# EAGLE design encoder_breakout (EAGLE 9.6.0)
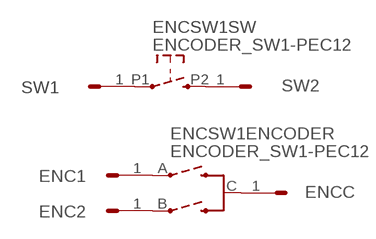
[diagram p0: schematic, sheet 1]

## Parts
ENC1  HEADER/MALE/01  [HEADER/MALE/01]
ENC2  HEADER/MALE/01  [HEADER/MALE/01]
ENCC  HEADER/MALE/01  [HEADER/MALE/01]
ENCSW1  ENCODER_SW1-PEC12  [PEC12_INCREMENTAL_ENCODER]
SW1  HEADER/MALE/01  [HEADER/MALE/01]
SW2  HEADER/MALE/01  [HEADER/MALE/01]

## Nets
N$1: ENC1.1 ENCSW1.A(ENCODER:A)
N$2: ENC2.1 ENCSW1.B(ENCODER:B)
N$3: ENCC.1 ENCSW1.C(ENCODER:C)
N$4: ENCSW1.P1 SW1.1
N$5: ENCSW1.P2 SW2.1

## Library data of the parts
ENC1 ENC2 ENCC SW1 SW2 = connectors:HEADER/MALE/01
ENCSW1 = controls:ENCODER_SW1: Incremental Encoder with push switch

## Board
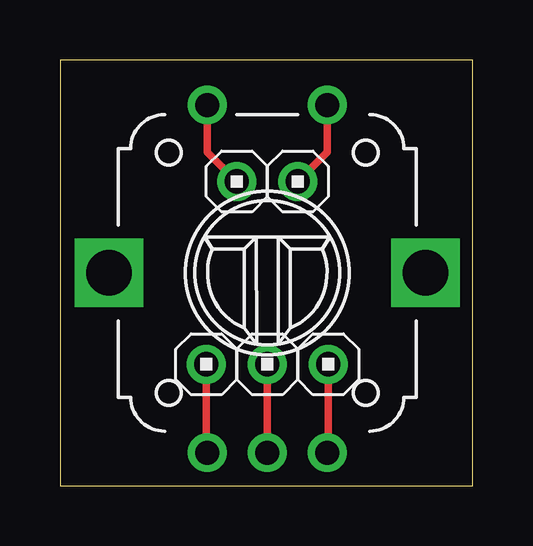
[diagram p1: board, top side]

Size 17.2 x 17.77 mm. Coordinates in mm from the lower left corner, seen from the top.
Outline: 0,0 17.2,0 17.2,17.77 0,17.77 0,0
Copper layers (1*16): Top 0.0356mm / dielectric 1.5011mm / Bottom 0.0356mm
Design rules "pigatron": minimum track width 12mil, minimum drill 13mil, track to track 15mil, track to pad 10mil, pad to pad 10mil, via to via 10mil, smd to smd 6mil, copper to edge 15mil, drill to drill 10mil, minimum pad ring 12mil, minimum via ring 10mil, stop-mask expansion 4mil, vias tented up to drill 0mil, thermal gap 10mil

### Footprints (pad centres in the part's own frame; a part is rotated, then mirrored left to right if it is on the bottom)
HEADER/MALE/01 = drill 1.016: 1 0,0
PEC12_INCREMENTAL_ENCODER = drill 1: A -2.5,-7.5; B 2.5,-7.5; C 0,-7.5; P1 -2.5,7; P2 2.5,7 | drill 1.9 square: GND@1 -6.6,0; GND@2 6.6,0

### Placement (x,y rotation side)
ENC1  6.1,5.08 0 top
ENC2  11.18,5.08 0 top
ENCC  8.64,5.08 0 top
ENCSW1  8.64,8.89 0 top
SW1  7.37,12.7 0 top
SW2  9.91,12.7 0 top

### Tracks (layer width: path | path; a pad name or v marks a point on that pad's centre or on a via)
N$1
  Top 0.305: ENC1.1 6.1,1.43 ENCSW1.A
N$2
  Top 0.305: ENC2.1 11.18,1.43 ENCSW1.B
N$3
  Top 0.305: ENCC.1 ENCSW1.C
N$4
  Top 0.305: ENCSW1.P1 6.14,13.93 SW1.1
N$5
  Top 0.305: ENCSW1.P2 11.14,13.93 SW2.1

### Text on the board
bNames: SWITCH | ENCODER